# Altium schematic sheet Q1_STM32_Buck_MCU.SchDoc
size A4; SheetNumber: 1; SheetTotal: 2
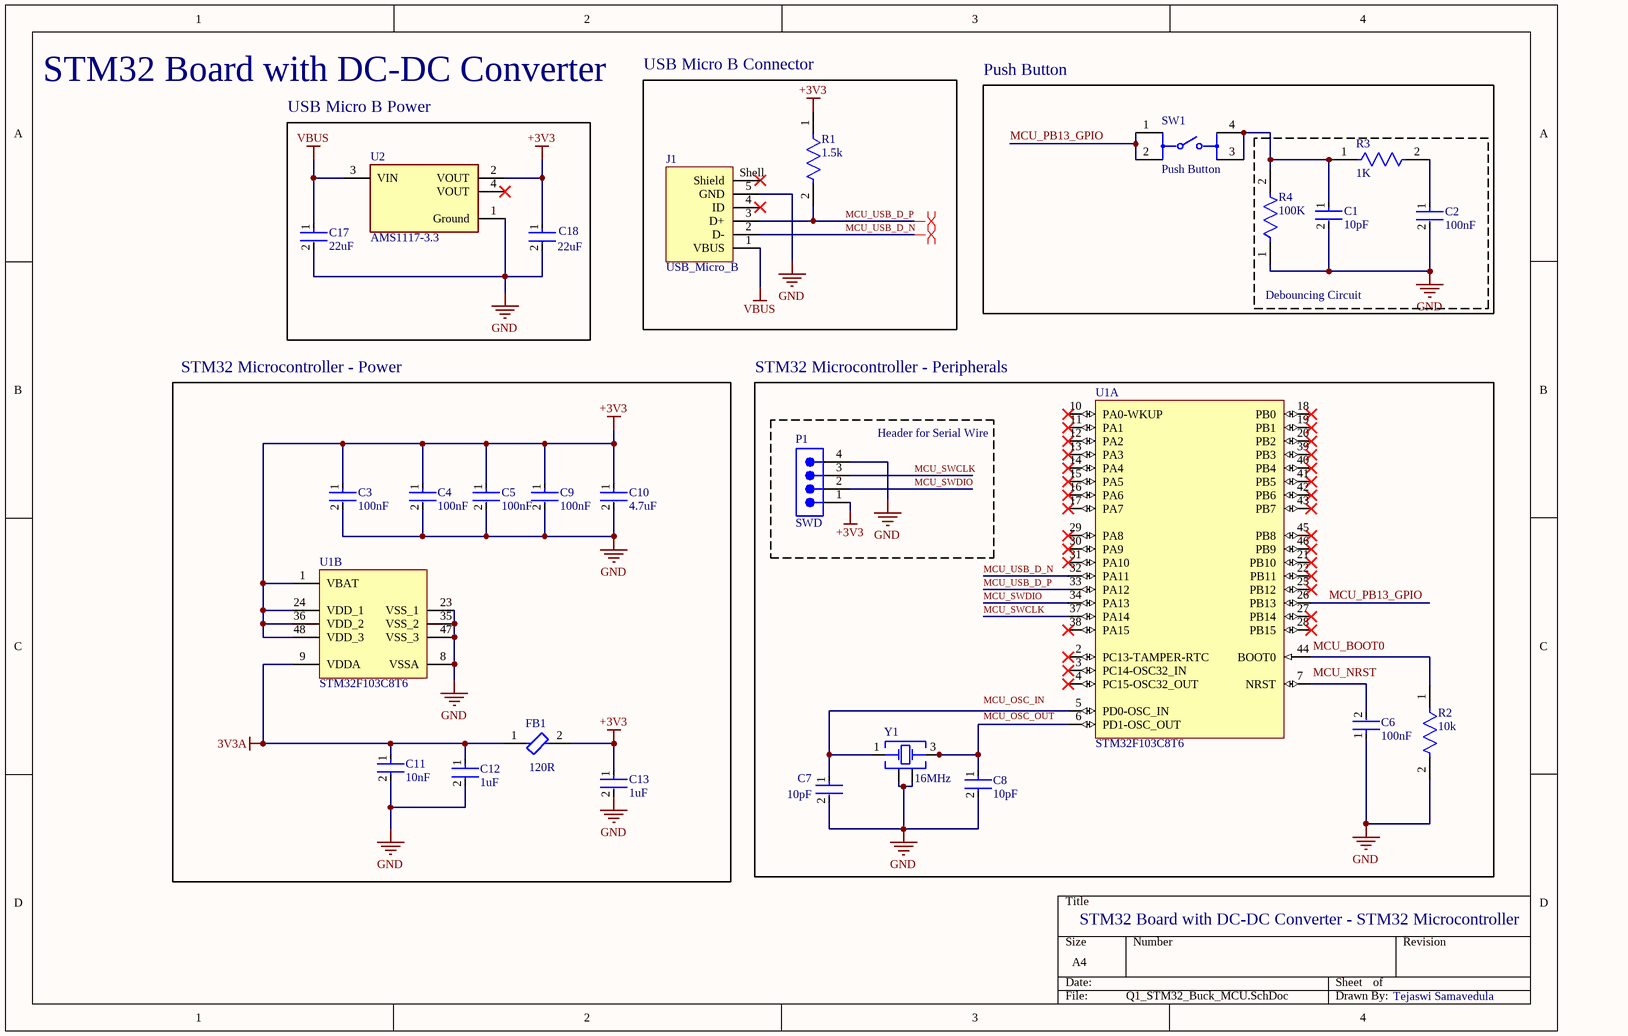
[diagram p0: Q1_STM32_Buck_MCU.SchDoc]

## Parts
C1  10pF  [FP-CC0402-MFG]
C2  100nF  [FP-CC0402-MFG]
C3  100nF  [FP-CC0402-MFG]
C4  100nF  [FP-CC0402-MFG]
C5  100nF  [FP-CC0402-MFG]
C6  100nF  [FP-CC0402-MFG]
C7  10pF  [FP-CC0402-MFG]
C8  10pF  [FP-CC0402-MFG]
C9  100nF  [FP-CC0402-MFG]
C10  4.7uF  [FP-GRM188-0_2-IPC_A]
C11  10nF  [FP-CC0402-MFG]
C12  1uF  [FP-CC0402-MFG]
C13  1uF  [FP-CC0402-MFG]
C17  22uF  [FP-GRM188-0_2-IPC_C]
C18  22uF  [FP-GRM188-0_2-IPC_C]
FB1  120R  [FP-BLM15-0_05-IPC_B]
J1  USB_Micro_B  [629105150521]
P1  SWD  [61300411121]
R1  1.5k  [FP-ERA2A-MFG]
R2  10k  [FP-ERA2A-MFG]
R3  1K  [FP-RCA0603-e3-MFG]
R4  100K  [FP-RK73H1J-IPC_C]
SW1  Push Button  [FP-1977223-1-MFG]
U1  STM32F103C8T6  [STM-LQFP48_L]  (parts A,B of 2)
U2  AMS1117-3.3  [FP-AMS1117-IPC_C]
Y1  16MHz  [WE-XTAL_IQXC-42]

## Blocks framed on the sheet
USB Micro B Connector: J1 R1
Push Button: SW1
USB Micro B Power: C17 C18 U2
Debouncing Circuit: C1 C2 R3 R4
STM32 Microcontroller - Power: C3-C5 C9-C13 FB1 U1
Header for Serial Wire: P1

## Nets
3V3A: C11.1 C12.1 FB1.1 U1.9(VDDA)
+3V3: C3.1 C4.1 C5.1 C9.1 C10.1 C13.1 C18.1 FB1.2 P1.1 R1.1 U1.1(VBAT) U1.24(VDD_1) U1.36(VDD_2) U1.48(VDD_3) U2.2(VOUT)
GND: C1.2 C2.2 C3.2 C4.2 C5.2 C6.1 C7.2 C8.2 C9.2 C10.2 C11.2 C12.2 C13.2 C17.2 C18.2 J1.5(GND) P1.4 R2.2 R4.1 U1.8(VSSA) U1.23(VSS_1) U1.35(VSS_2) U1.47(VSS_3) U2.1(Ground) Y1.2(GND) Y1.4(GND)
VBUS: C17.1 J1.1(VBUS) U2.3(VIN)
MCU_PB13_GPIO: SW1.1 SW1.2 U1.26(PB13)
MCU_SWCLK: P1.3 U1.37(PA14)
MCU_SWDIO: P1.2 U1.34(PA13)
MCU_USB_D_N: J1.2(D-) U1.32(PA11)
MCU_USB_D_P: J1.3(D+) R1.2 U1.33(PA12)
NetC1_1: C1.1 R3.1 R4.2 SW1.3 SW1.4
NetC2_1: C2.1 R3.2
NetC6_2: C6.2 U1.7(NRST)
NetC7_1: C7.1 U1.5(PD0-OSC_IN) Y1.1(Crystal)
NetC8_1: C8.1 U1.6(PD1-OSC_OUT) Y1.3(Crystal)
NetR2_1: R2.1 U1.44(BOOT0)

Not connected (* = marked no-connect by the designer): J1 4(ID)* Shell(Shield)*; U1 2(PC13-TAMPER-RTC)* 3(PC14-OSC32_IN)* 4(PC15-OSC32_OUT)* 10(PA0-WKUP)* 11(PA1)* 12(PA2)* 13(PA3)* 14(PA4)* 15(PA5)* 16(PA6)* 17(PA7)* 18(PB0)* 19(PB1)* 20(PB2)* 21(PB10)* 22(PB11)* 25(PB12)* 27(PB14)* 28(PB15)* 29(PA8)* 30(PA9)* 31(PA10)* 38(PA15)* 39(PB3)* 40(PB4)* 41(PB5)* 42(PB6)* 43(PB7)* 45(PB8)* 46(PB9)*; U2 4(VOUT)*

## Layout directives
differential pair: MCU_USB_D_N, MCU_USB_D_P

## Notes on the sheet
- STM32 Board with DC-DC Converter
- STM32 Microcontroller - Peripherals
- STM32 Board with DC-DC Converter - STM32 Microcontroller
- Tejaswi Samavedula
- Labels drawn without touching a wire or pin: MCU_BOOT0, MCU_NRST, MCU_OSC_IN, MCU_OSC_OUT

## Library data of the parts
C1-C9 C11-C13 = CMP-03422-001312-1: CAP CER 0.1UF 16V X5R 0402; Manufacturer Part Number: CC0402MRX5R7BB104; Manufacturer: YAGEO; Automotive Grade: NA; Material: Ceramic; Tolerance: 0.2; Temperature Coefficient: 30ppm/°C; Temperature: -55°C to +125°C; Footprint Url: http://www.yageo.com/exep/pages/download/literatures/UPY-C_GEN_24.pdf; Height: 0.55mm; Ipc Land Pattern Name: CAPC10050X50; Digikey Description: CAP CER 0.1UF 16V X5R 0402; Device Class L2: Capacitors; Mouser Description: Multilayer Ceramic Capacitors MLCC - SMD/SMT 100nF 16V X5R 20%; Octopart: https://octopart.com/cc0402mrx5r7bb104-yageo-33242280; ComponentLink2Description: Datasheet; Temperature Range Low: -55°C; RoHS: TRUE; Device Class L3: Ceramic Capacitors; Automotive: No; Temperature Characteristic: X5R; Temperature Range High: +125°C; Device Class L1: Passive Components; Package: CC0402; Lead Free: Yes; Voltage Rating: 16 V; Category: Cap; ComponentLink2URL: http://www.yageo.com/documents/recent/UPY-GP_NP0_16V-to-50V_16.pdf
  C1 C7 C8: Value: 10 pF; Capacitance: 10 pF
  C2-C6 C9: Value: 100 nF; Capacitance: 100 nF
  C11: Value: 10 nF; Capacitance: 10 nF
  C12 C13: Value: 1uF; Capacitance: 1uF
C10 = CMP-06035-002362-1: Chip Multilayer Ceramic Capacitors for General Purpose, 0603, 4.7uF, X7S, 22%, 10%, 16V; Capacitance: 4.7uF; Dielectric: X7S; Voltage Rating (DC): 16V; Thickness: 800um; Tolerance: 10%; Length: 1.6mm; Width: 800um
C17 C18 = CMP-2000-06337-3: Chip Multilayer Ceramic Capacitors for General Purpose, 0603, 22uF, X5R, 15%, 20%, 10V; Tolerance: 20%; Weight: 0.000222oz; Material: Ceramic; Depth: 0.8mm; Length: 1.6mm; Termination: SMD/SMT; Capacitance: 22uF; Packaging: Tape and Reel; Width: 0.8mm; Voltage Rating: 10V; Case Code (Imperial): 0603; Mount: Surface Mount; Voltage Rating (DC): 10V; Case/Package: 0603; Thickness: 0.039inch; REACH SVHC: No SVHC; Dielectric: X5R; Height: 0.8mm; Package Quantity: 4000; Case Code (Metric): 1608; Min Operating Temperature: -55°C; Lead Free: Lead Free; Max Operating Temperature: 85°C
FB1 = CMP-0686-00181-5: Chip Ferrite Bead, 0402, 1000Ω @ 100MHz, 0.65Ω, 25%, 300mA; DC Current: 200mA; Number of Circuits: 1; Shielding: Unshielded; Impedance: 120; DC Resistance (DCR): 650mR; DC Resistance-Max: 1R; Packaging: Tape and Reel; Case Code (Imperial): 0402; Military Standard: Not; Min Operating Temperature: -55°C; Width: 0.5mm; Tolerance: 25%; Material: Ferrite; Number of Lines: 1; Max Current Rating: 300mA; Depth: 0.55mm; Package Quantity: 1; Case/Package: 0402; Series: BLM15AG_SN; Case Code (Metric): 1005; Max Operating Temperature: 125°C; Lead Free: Lead Free; Test Frequency: 100MHz; RoHS Compliant: Yes; Radiation Hardening: No; Number of Pins: 2; Core Material: Ferrite; Current Rating: 300mA; Frequency: 100MHz; Max DC Current: 200mA; REACH SVHC: No SVHC; Length: 1mm; Termination: SMD/SMT; Height: 0.5mm
J1 = CMP-1502-03252-3: NexarPartId: 52645113; Number of Contacts: 5; Contact Resistance: 30mΩ; Connector Type: USB; Voltage Rating: 30V; Current Rating: 3A; USB Standard: USB 2.0; Gender: Receptacle; Insulation Resistance: 1GΩ; Height: 2.86mm; REACH SVHC: Unknown; RoHS: Compliant; Features: Shielded; Termination: SMD/SMT; Number of Pins: 5; Contact Plating: Gold; Packaging: Tape and Reel; Contact Material: Gold; Mount: Horizontal, Surface Mount; Max Operating Temperature: 85°C; Lead Free: Lead Free; Min Operating Temperature: -40°C; Orientation: Horizontal; Operating Supply Voltage: 30V
P1 = CMP-1502-01064-3: NexarPartId: 32855522; Operating Supply Voltage: 250V; Pitch: 2.54mm; Contact Resistance: 20mΩ; Number of Positions: 4; Current Rating: 3A; Connector Type: Male Pin; Gender: Male; Contact Plating: Gold; Height: 8.89mm; Lead Pitch: 2.54mm; Lead Free: Lead Free; Contact Mating Length: 5.9944mm; Number of Rows: 1; Termination: Solder; Packaging: Bulk; REACH SVHC: Unknown; Min Operating Temperature: -40°C; RoHS: Compliant; Number of Contacts: 4; Voltage Rating: 250V; Color: Black; Max Operating Temperature: 105°C; Contact Material: Copper; Mount: Through Hole; Orientation: Vertical; Number of Pins: 4
R1 = CMP-2002-05875-2: RES SMD 10K OHM 0.1% 1/16W 0402; Manufacturer Part Number: ERA-2AEB103X; Manufacturer: Panasonic; Temperature Coefficient: 25ppm/°C; Automotive Grade: Grade 0; Resistance: 1.5kΩ; Power Rating: 0.063W; Voltage Rating: 50V; Value: 1.5kΩ; RoHS: TRUE; Device Class L3: Chip SMD Resistors; Automotive: Yes; Series: ERA; Height: 0.4mm; Package: ERA2A; Temperature Range Low: -55°C; ComponentLink2Description: Datasheet; Tolerance: 0.1%; Device Class L2: Resistors; Temperature Range High: +155°C; Device Class L1: Passive Components; Digikey Description: RES SMD 10K OHM 0.1% 1/16W 0402; Category: Res; Mouser Description: Thin Film Resistors - SMD 0402 1/16W 10Kohms; Lead Free: Yes; Footprint Url: https://industrial.panasonic.com/cdbs/www-data/pdf/RDM0000/DMM0000COL17.pdf; Composition: Metal Film; Octopart: https://octopart.com/era-2aeb103x-panasonic-9251377; ComponentLink2URL: https://industrial.panasonic.com/cdbs/www-data/pdf/RDM0000/AOA0000C307.pdf; Temperature: -55°C to +155°C
R2 = CMP-2002-05875-2: RES SMD 10K OHM 0.1% 1/16W 0402; Manufacturer Part Number: ERA-2AEB103X; Manufacturer: Panasonic; Temperature Coefficient: 25ppm/°C; Automotive Grade: Grade 0; Resistance: 10kΩ; Power Rating: 0.063W; Voltage Rating: 50V; Value: 10kΩ; RoHS: TRUE; Device Class L3: Chip SMD Resistors; Automotive: Yes; Series: ERA; Height: 0.4mm; Package: ERA2A; Temperature Range Low: -55°C; ComponentLink2Description: Datasheet; Tolerance: 0.1%; Device Class L2: Resistors; Temperature Range High: +155°C; Device Class L1: Passive Components; Digikey Description: RES SMD 10K OHM 0.1% 1/16W 0402; Category: Res; Mouser Description: Thin Film Resistors - SMD 0402 1/16W 10Kohms; Lead Free: Yes; Footprint Url: https://industrial.panasonic.com/cdbs/www-data/pdf/RDM0000/DMM0000COL17.pdf; Composition: Metal Film; Octopart: https://octopart.com/era-2aeb103x-panasonic-9251377; ComponentLink2URL: https://industrial.panasonic.com/cdbs/www-data/pdf/RDM0000/AOA0000C307.pdf; Temperature: -55°C to +155°C
R3 = CMP-00030-22249381-1: RCA06031K00FKEA SMD Chip Resistor, 1 kOhm, ± 1%, 100 mW, 0603 [1608 Metric], Thick Film, Anti-Sulfur; Max Power Dissipation: 100mW; Temperature Coefficient: 100ppm/°C; Voltage Rating (DC): 75V; Resistance: 1kΩ; Number of Terminations: 2; Packaging: Cut Tape; Features: Anti-Sulfur, Automotive AEC-Q200; RoHS: Compliant; Power Rating: 100mW; Composition: Thick Film; Radiation Hardening: No; Voltage Rating: 75V; REACH SVHC: No SVHC; Schedule B: 8533210045; Depth: 850µm; Military Standard: Not; Case Code (Metric): 1608; Contact Plating: Tin; Tolerance: 1%; NexarPartId: 22249381; Max Operating Temperature: 155°C; Mount: Surface Mount; Length: 1.55mm; Case Code (Imperial): 0603; Width: 838.2µm; Min Operating Temperature: -55°C; Case/Package: 0603; Height: 508µm
R4 = CMP-04015-074272-1: 100kΩ ±1% 0.1W Chip Resistor 0603 Thick Film AEC-Q200 Qualified; Temperature Coefficient: 100ppm/°C; Power Rating: 100mW; Voltage Rating: 50V; Resistance: 100kR; Series: RK73H; Case/Package: 0603; Max Operating Temperature: 155°C; Case Code (Imperial): 0603; Length: 1.6mm; Package Quantity: 5000; Min Operating Temperature: -55°C; Tolerance: 1%; Termination: SMD/SMT; Packaging: Tape and Reel; Case Code (Metric): 1608; Height: 0.45mm; Width: 0.8mm; Lead Free: Contains Lead
SW1 = CMP-03790-42203485-1: 1977223-1 Pushbutton Switch, SPST, Momentary, 0.05A, 24VDC, Solder Terminal, Panel Mount; Manufacturer Lifecycle Status: ACTIVE; Switch Function: Off-Mom; Illumination Type: Illuminated, Non-Illuminated; Max Voltage Rating (DC): 24V; Switch Travel: 250µm; Number of Positions: 2; Contact Current Rating: 50mA; Mechanical Life: 1Mcycles; Actuator Length: 700µm; Actuator Material: Nylon, Polyamide; Max Operating Temperature: 105°C; Packaging: Bulk; Type: Switch; Material: Polyamide; Termination: Gull Wing; Voltage Rating (DC): 24V; Height: 4.3mm; NexarPartId: 42203485; Contact Plating: Silver; Lifecycle Status: Production; RoHS: Compliant; Radiation Hardening: No; Case/Package: SMD/SMT; Throw Configuration: SPST; REACH SVHC: No SVHC; Current Rating: 50mA; Mount: Surface Mount; Min Operating Temperature: -40°C; Housing Material: Polyphenylene; ELV: Compliant
U1 = CMP-0237-00215-3: ARM Cortex-M3 32-bit MCU, 64 KB Flash, 20 KB Internal RAM, 37 I/Os, 48-pin LQFP, -40 to 85 degC, Tray; Supply Voltage(Vcc) min (V): 2; Internal RAM Size (kB): 20; FLASH Size (Prog) (kB): 64; A/D Converter: 2x12-bit (10 Channel); I/Os (High Current): 37; Operating Frequency(F) (Processor speed) (MHz): 72; Core: ARM Cortex-M3; ComponentLink3Description: Package Specification; Mounting Technology: Surface Mount; PartNumber: STM32F103C8T6; PackageReference: LQFP48; Packing: Tray; ComponentLink3URL: http://www.st.com/st-web-ui/static/active/en/resource/technical/document/datasheet/DM00058181.pdf; DatasheetVersion: Rev. 16; ComponentLink1URL: http://www.st.com/web/en/home.html; PackageVersion: Rev. 6, 06/2013; ComponentLink2URL: http://www.st.com/st-web-ui/static/active/en/resource/technical/document/datasheet/CD00161566.pdf; ComponentLink1Description: Manufacturer URL; ComponentLink2Description: Datasheet; PackageDescription: 48-Pin Low Profile Quad Flat Package, 7 x 7 mm Body, 0.5 mm Pitch
U2 = CMP-209535-000001-1: LDO Voltage Regulators 1A, 3.3V; Manufacturer: Advanced Monolithic Systems; Dropout Voltage: 1.1V; Output Type: Fixed; Nominal Supply Current: 5mA; Max Power Dissipation: 1.2W; Max Supply Voltage: 15V; Number Of Outputs: 1; Standoff Height: 0.64mm; Max Junction Temp: +125°C; Height: 1.8mm; Package: AMS1117; Device Class L2: Power Management ICs; ComponentLink2Description: Datasheet; ComponentLink2URL: http://www.advanced-monolithic.com/pdf/ds1117.pdf; Category: IC; RoHS: TRUE; Automotive: No; Device Class L1: Integrated Circuits (ICs); Output Current: 1A; Device Class L3: Voltage Regulators - Linear; Temperature: -40°C to +125°C; Output Voltage: 3.3V; Manufacturer Part Number: AMS1117-3.3; Temperature Range Low: -40°C; Octopart: https://octopart.com/ams1117-3.3-advanced+monolithic+systems-25899300; Lead Free: Yes; Ipc Land Pattern Name: SOT229P700X180-4; Temperature Range High: +125°C
Y1 = CMP-03913-116855783-1: 830108288709 WE-XTAL Quartz Crystal; Frequency: 16MHz; Width: 1.6mm; Length: 2mm; Max Operating Temperature: 105°C; NexarPartId: 116855783; Min Operating Temperature: -40°C; Height: 500µm